# Altium project SynthyTwo.Project.PrjPcb
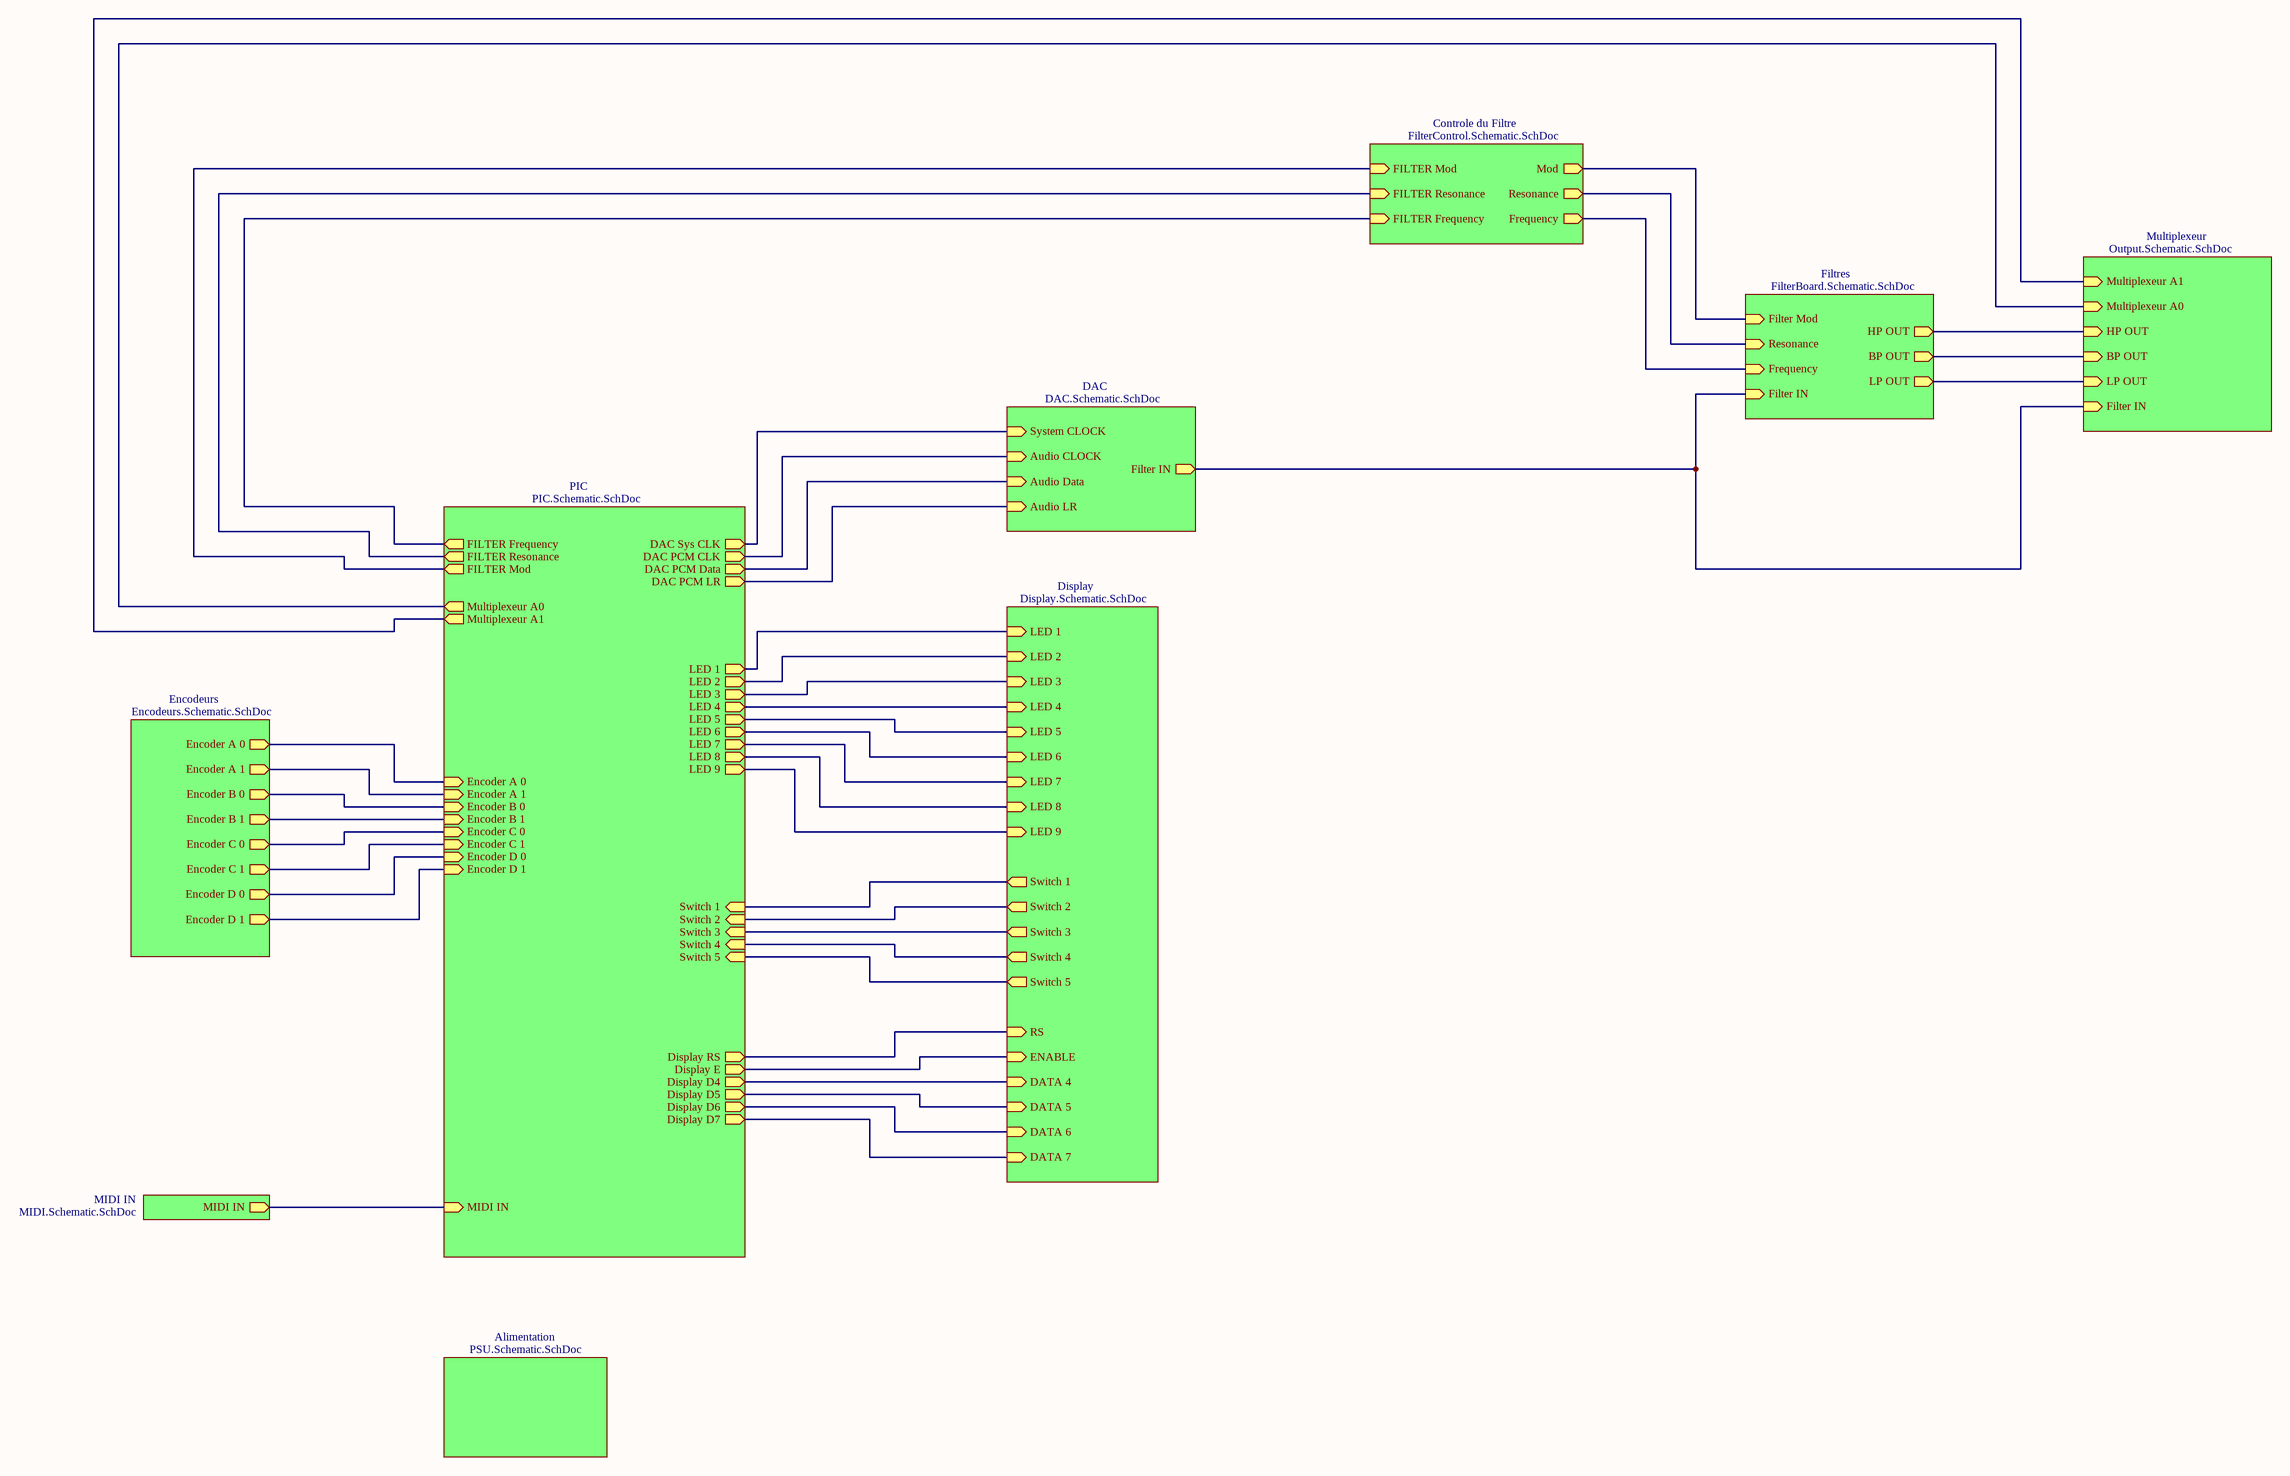
[diagram p0: LINK_PIC.SchDoc]
10 sheets, 235 parts. Net scope: hierarchical (ports join the sheet entries above them; power ports are global).
Board file: PCBROUTAGE.PcbDoc
Sheets:
  LINK_PIC.SchDoc
    Filtres = FilterBoard.Schematic.SchDoc
    Multiplexeur = Output.Schematic.SchDoc
    DAC = DAC.Schematic.SchDoc
    Controle du Filtre = FilterControl.Schematic.SchDoc
    MIDI IN = MIDI.Schematic.SchDoc
    PIC = PIC.Schematic.SchDoc
    Display = Display.Schematic.SchDoc
    Encodeurs = Encodeurs.Schematic.SchDoc
    Alimentation = PSU.Schematic.SchDoc

## Sheet LINK_PIC.SchDoc
size C

### Sub-sheets
Alimentation = PSU.Schematic.SchDoc: no entries
Controle du Filtre = FilterControl.Schematic.SchDoc: Frequency (out), Resonance (out), Mod (out), FILTER Frequency (in), FILTER Resonance (in), FILTER Mod (in)
DAC = DAC.Schematic.SchDoc: Filter IN (out), System CLOCK (in), Audio Data (in), Audio CLOCK (in), Audio LR (in)
Display = Display.Schematic.SchDoc: LED 1 (in), LED 2 (in), LED 3 (in), LED 4 (in), LED 5 (in), LED 6 (in), LED 7 (in), LED 8 (in), LED 9 (in), Switch 1 (out), Switch 2 (out), Switch 3 (out), Switch 4 (out), Switch 5 (out), RS (in), ENABLE (in), DATA 4 (in), DATA 5 (in), DATA 6 (in), DATA 7 (in)
Encodeurs = Encodeurs.Schematic.SchDoc: Encoder A 0 (out), Encoder A 1 (out), Encoder B 0 (out), Encoder B 1 (out), Encoder C 0 (out), Encoder C 1 (out), Encoder D 0 (out), Encoder D 1 (out)
Filtres = FilterBoard.Schematic.SchDoc: Filter IN (in), Filter Mod (in), Frequency (in), Resonance (in), BP OUT (out), HP OUT (out), LP OUT (out)
MIDI IN = MIDI.Schematic.SchDoc: MIDI IN (out)
Multiplexeur = Output.Schematic.SchDoc: Filter IN (in), BP OUT (in), HP OUT (in), LP OUT (in), Multiplexeur A0 (in), Multiplexeur A1 (in)
PIC = PIC.Schematic.SchDoc: LED 2 (out), LED 1 (out), LED 4 (out), LED 3 (out), LED 6 (out), LED 5 (out), LED 8 (out), LED 7 (out), LED 9 (out), DAC Sys CLK (out), DAC PCM CLK (out), DAC PCM Data (out), DAC PCM LR (out), Switch 1 (in), Switch 2 (in), Switch 3 (in), Switch 4 (in), Switch 5 (in), Display D4 (out), Display D5 (out), Display D6 (out), Display D7 (out), Display E (out), Display RS (out), MIDI IN (in), FILTER Frequency (out), FILTER Resonance (out), FILTER Mod (out), Multiplexeur A0 (out), Multiplexeur A1 (out), Encoder A 0 (in), Encoder A 1 (in), Encoder B 0 (in), Encoder B 1 (in), Encoder C 0 (in), Encoder C 1 (in), Encoder D 0 (in), Encoder D 1 (in)

### Nets
NetC14_2: sheet Filtres/Filter IN, sheet Multiplexeur/Filter IN, sheet DAC/Filter IN
NetDisplay_4: sheet PIC/Display RS, sheet Display/RS
NetDisplay_6: sheet PIC/Display E, sheet Display/ENABLE
NetDisplay_7: sheet PIC/Display D7, sheet Display/DATA 7
NetDisplay_8: sheet PIC/Display D6, sheet Display/DATA 6
NetDisplay_9: sheet PIC/Display D5, sheet Display/DATA 5
NetDisplay_10: sheet PIC/Display D4, sheet Display/DATA 4
NetR6_1: sheet MIDI IN/MIDI IN, sheet PIC/MIDI IN
NetR9_1: sheet DAC/System CLOCK, sheet PIC/DAC Sys CLK
NetR10_1: sheet DAC/Audio Data, sheet PIC/DAC PCM Data
NetR11_1: sheet DAC/Audio CLOCK, sheet PIC/DAC PCM CLK
NetR12_1: sheet DAC/Audio LR, sheet PIC/DAC PCM LR
NetR14_2: sheet Filtres/HP OUT, sheet Multiplexeur/HP OUT
NetR15_2: sheet Filtres/BP OUT, sheet Multiplexeur/BP OUT
NetR22_2: sheet Filtres/LP OUT, sheet Multiplexeur/LP OUT
NetR48_1: sheet Filtres/Resonance, sheet Controle du Filtre/Resonance
NetR53_1: sheet Filtres/Filter Mod, sheet Controle du Filtre/Mod
NetR57_1: sheet Filtres/Frequency, sheet Controle du Filtre/Frequency
NetR65_1: sheet Controle du Filtre/FILTER Frequency, sheet PIC/FILTER Frequency
NetR71_1: sheet Controle du Filtre/FILTER Resonance, sheet PIC/FILTER Resonance
NetR76_1: sheet Controle du Filtre/FILTER Mod, sheet PIC/FILTER Mod
NetR86_1: sheet PIC/LED 1, sheet Display/LED 1
NetR87_1: sheet PIC/LED 2, sheet Display/LED 2
NetR88_1: sheet PIC/LED 3, sheet Display/LED 3
NetR89_1: sheet PIC/Switch 5, sheet Display/Switch 5
NetR90_1: sheet PIC/Switch 4, sheet Display/Switch 4
NetR91_1: sheet PIC/Switch 3, sheet Display/Switch 3
NetR92_1: sheet PIC/Switch 2, sheet Display/Switch 2
NetR93_1: sheet PIC/Switch 1, sheet Display/Switch 1
NetR94_1: sheet PIC/LED 4, sheet Display/LED 4
NetR95_1: sheet PIC/LED 5, sheet Display/LED 5
NetR96_1: sheet PIC/LED 6, sheet Display/LED 6
NetR97_1: sheet PIC/LED 7, sheet Display/LED 7
NetR98_1: sheet PIC/LED 8, sheet Display/LED 8
NetR99_1: sheet PIC/LED 9, sheet Display/LED 9
NetR108_1: sheet PIC/Encoder A 0, sheet Encodeurs/Encoder A 0
NetR109_1: sheet PIC/Encoder A 1, sheet Encodeurs/Encoder A 1
NetR110_1: sheet PIC/Encoder B 0, sheet Encodeurs/Encoder B 0
NetR111_1: sheet PIC/Encoder B 1, sheet Encodeurs/Encoder B 1
NetR112_1: sheet PIC/Encoder C 0, sheet Encodeurs/Encoder C 0
NetR113_1: sheet PIC/Encoder C 1, sheet Encodeurs/Encoder C 1
NetR114_1: sheet PIC/Encoder D 0, sheet Encodeurs/Encoder D 0
NetR115_1: sheet PIC/Encoder D 1, sheet Encodeurs/Encoder D 1
NetU1_47: sheet Multiplexeur/Multiplexeur A1, sheet PIC/Multiplexeur A1
NetU1_48: sheet Multiplexeur/Multiplexeur A0, sheet PIC/Multiplexeur A0

## Sheet FilterBoard.Schematic.SchDoc
size B
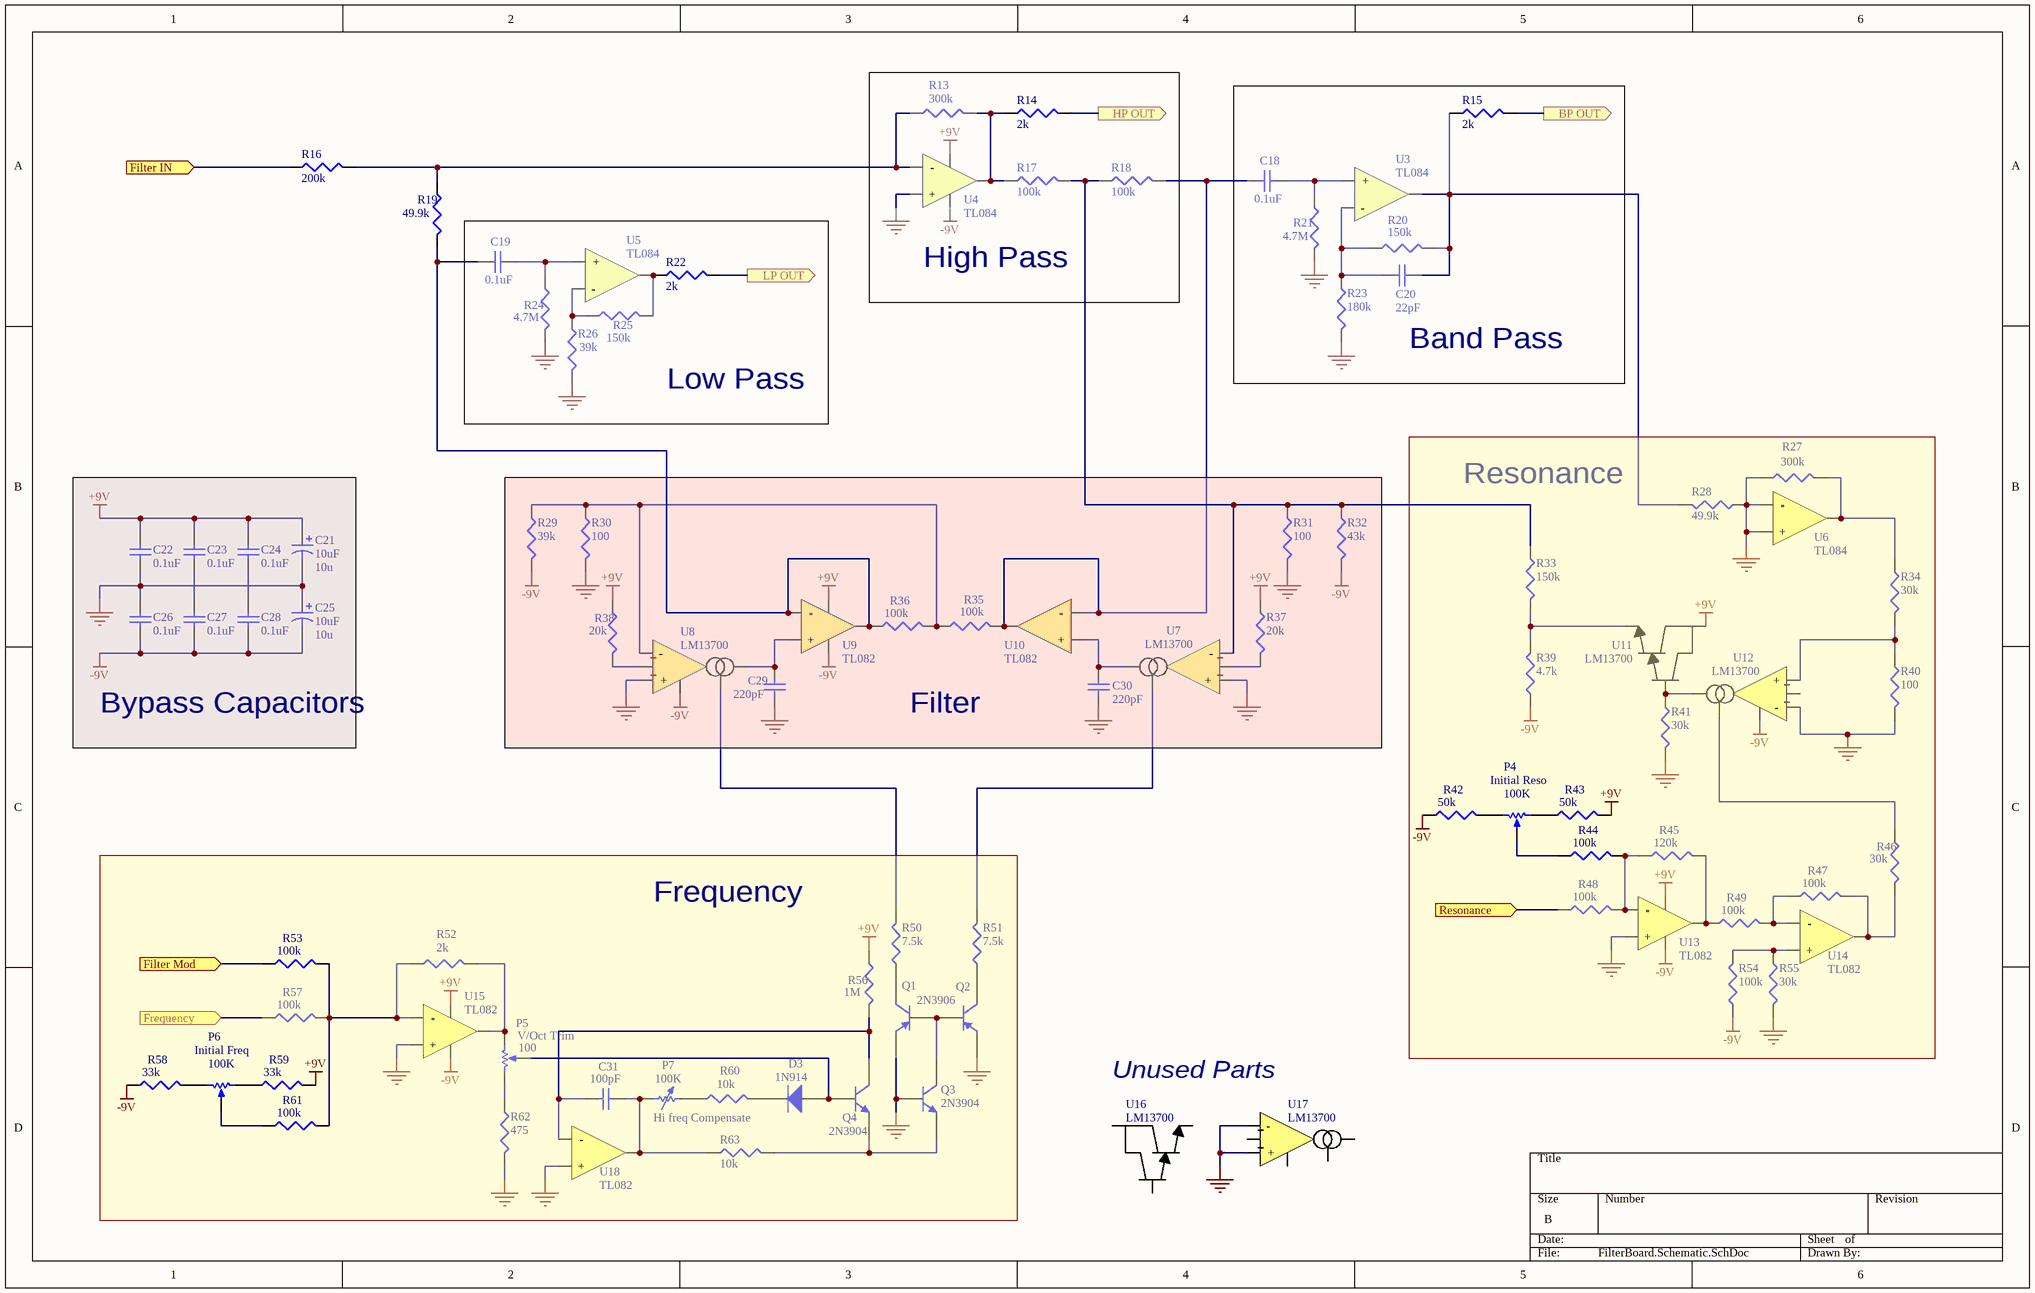
[diagram p1: FilterBoard.Schematic.SchDoc]

### Parts
C18  0.1uF  [CAPC1608N]
C19  0.1uF  [CAPC1608N]
C20  22pF  [CAPC1608N]
C21  10uF  value 10u  [RB7.6-15]
C22  0.1uF  [CAPC1608N]
C23  0.1uF  [CAPC1608N]
C24  0.1uF  [CAPC1608N]
C25  10uF  value 10u  [RB7.6-15]
C26  0.1uF  [CAPC1608N]
C27  0.1uF  [CAPC1608N]
C28  0.1uF  [CAPC1608N]
C29  220pF  [CAPC1608N]
C30  220pF  [CAPC1608N]
C31  100pF  [CAPC1608N]
D3  1N914  [1N914]
P4  Initial Reso  value 100K  [VR5]
P5  V/Oct Trim  value 100  [VR5]
P6  Initial Freq  value 100K  [VR5]
P7  Hi freq Compensate  value 100K  [CAPC1608N]
Q1  2N3906  [2N3906]
Q2  2N3906  [2N3906]  (value not drawn)
Q3  2N3904  [TO-92A]
Q4  2N3904  [TO-92A]
R13  300k  [CAPC1608N]
R14  2k  [CAPC1608N]
R15  2k  [CAPC1608N]
R16  200k  [CAPC1608N]
R17  100k  [CAPC1608N]
R18  100k  [CAPC1608N]
R19  49.9k  [CAPC1608N]
R20  150k  [CAPC1608N]
R21  4.7M  [CAPC1608N]
R22  2k  [CAPC1608N]
R23  180k  [CAPC1608N]
R24  4.7M  [CAPC1608N]
R25  150k  [CAPC1608N]
R26  39k  [CAPC1608N]
R27  300k  [CAPC1608N]
R28  49.9k  [CAPC1608N]
R29  39k  [CAPC1608N]
R30  100  [CAPC1608N]
R31  100  [CAPC1608N]
R32  43k  [CAPC1608N]
R33  150k  [CAPC1608N]
R34  30k  [CAPC1608N]
R35  100k  [CAPC1608N]
R36  100k  [CAPC1608N]
R37  20k  [CAPC1608N]
R38  20k  [CAPC1608N]
R39  4.7k  [CAPC1608N]
R40  100  [CAPC1608N]
R41  30k  [CAPC1608N]
R42  50k  [CAPC1608N]
R43  50k  [CAPC1608N]
R44  100k  [CAPC1608N]
R45  120k  [CAPC1608N]
R46  30k  [CAPC1608N]
R47  100k  [CAPC1608N]
R48  100k  [CAPC1608N]
R49  100k  [CAPC1608N]
R50  7.5k  [CAPC1608N]
R51  7.5k  [CAPC1608N]
R52  2k  [CAPC1608N]
R53  100k  [CAPC1608N]
R54  100k  [CAPC1608N]
R55  30k  [CAPC1608N]
R56  1M  [CAPC1608N]
R57  100k  [CAPC1608N]
R58  33k  [CAPC1608N]
R59  33k  [CAPC1608N]
R60  10k  [CAPC1608N]
R61  100k  [CAPC1608N]
R62  475  [CAPC1608N]
R63  10k  [CAPC1608N]
U3  TL084
U4  TL084
U5  TL084
U6  TL084
U7  LM13700  [LM13700]
U8  LM13700  [LM13700]
U9  TL082  [TL084]
U10  TL082  [TL084]
U11  LM13700
U12  LM13700  [LM13700]
U13  TL082  [TL084]
U14  TL082  [TL084]
U15  TL082  [TL084]
U16  LM13700
U17  LM13700  [LM13700]
U18  TL082  [TL084]

### Blocks framed on the sheet
High Pass: R13 R14 R17 R18 U4
Band Pass: C18 C20 R15 R20 R21 R23 U3
Low Pass: C19 R22 R24-R26 U5
Resonance: P4 R27 R28 R33 R34 R39-R49 R54 R55 U6 U11-U14
Bypass Capacitors: C21-C28
Filter: C29 C30 R29-R32 R35-R38 U7-U10
Frequency: C31 D3 P5-P7 Q1-Q4 R50-R53 R56-R63 U15 U18

### Ports
BP OUT (out), Filter IN (in), Filter Mod (in), Frequency (in), HP OUT (out), LP OUT (out), Resonance (in)

### Nets
+9V: C21.1 C22.2 C23.2 C24.2 R37.1 R38.1 R43.2 R56.1 R59.2 U4.4(VCC+) U9.8(VCC+) U11.11(V+) U13.8(VCC+) U15.8(VCC+)
-9V: C25.2 C26.1 C27.1 C28.1 R29.2 R32.2 R39.1 R42.1 R54.1 R58.1 U4.11(VCC-) U8.6(VCC-) U9.4(VCC-) U12.6(VCC-) U13.4(VCC-) U15.4(VCC-)
GND: C21.2 C22.1 C25.1 C26.2 C29.1 C30.1 Q1.1(E) Q2.1(E) Q3.2(B) R21.2 R23.2 R24.2 R26.2 R27.1 R28.1 R30.2 R31.2 R40.2 R41.2 R55.2 R62.2 U4.3(+) U6.12(-) U6.13(+) U7.3(+) U8.3(+) U12.3(-) U13.3(+) U15.3(+) U17.3(+) U17.4(-) U18.5(+)
NetC14_2: R16.1 ; port Filter IN
NetC18_1: C18.1 R18.2 R35.2 U10.6(-) U10.7(OUT)
NetC18_2: C18.2 R21.1 U3.5(+)
NetC19_1: C19.1 R19.2 R36.1 U9.1(OUT) U9.2(-)
NetC19_2: C19.2 R24.1 U5.5(+)
NetC20_1: C20.1 R20.1 R23.1 U3.3(-)
NetC20_2: C20.2 R15.1 R20.2 R28.2 U3.7(OUT)
NetC23_1: C23.1 C27.2
NetC24_1: C24.1 C28.2
NetC29_2: C29.2 U8.5(OUT) U9.3(+)
NetC30_2: C30.2 U7.5(OUT) U10.5(+)
NetC31_1: C31.1 Q4.3(C) R56.2 U18.6(-)
NetC31_2: C31.2 P7.1 R63.1 U18.7(OUT)
NetD3_1: D3.1(A) P5.3(TAP) Q4.2(B)
NetD3_2: D3.2(K) R60.2
NetP4_1: P4.1(TOP) R43.1
NetP4_2: P4.2(BOT) R42.2
NetP4_3: P4.3(TAP) R44.1
NetP5_1: P5.1(TOP) R52.2 U15.1(OUT)
NetP5_2: P5.2(BOT) R62.1
NetP6_1: P6.1(TOP) R59.1
NetP6_2: P6.2(BOT) R58.2
NetP6_3: P6.3(TAP) R61.1
NetP7_2: P7.2 R60.1
NetQ1_2: Q1.2(B) Q2.2(B) Q3.3(C)
NetQ1_3: Q1.3(C) R50.1
NetQ2_3: Q2.3(C) R51.1
NetQ3_1: Q3.1(E) Q4.1(E) R63.2
NetR13_1: R13.1 R16.2 R19.1 U4.2(-)
NetR13_2: R13.2 R14.1 R17.1 U4.1(OUT)
NetR14_2: R14.2 ; port HP OUT
NetR15_2: R15.2 ; port BP OUT
NetR17_2: R17.2 R18.1 R31.1 R32.1 R33.1 U7.4(-)
NetR22_1: R22.1 R25.2 U5.7(OUT)
NetR22_2: R22.2 ; port LP OUT
NetR25_1: R25.1 R26.1 U5.3(-)
NetR27_2: R27.2 R34.1 U6.14(OUT)
NetR29_1: R29.1 R30.1 R35.1 R36.2 U8.4(-)
NetR33_2: R33.2 R39.2 U11.8(BOUT)
NetR34_2: R34.2 R40.1 U12.4(+)
NetR37_2: R37.2 U7.2
NetR38_2: R38.2 U8.2
NetR41_1: R41.1 U11.7(BIN) U12.5(OUT)
NetR44_2: R44.2 R45.1 R48.2 U13.2(-)
NetR45_2: R45.2 R49.1 U13.1(OUT)
NetR46_1: R46.1 U12.1(BIAS)
NetR46_2: R46.2 R47.2 U14.7(OUT)
NetR47_1: R47.1 R49.2 U14.6(-)
NetR48_1: R48.1 ; port Resonance
NetR50_2: R50.2 U8.1(BIAS)
NetR51_2: R51.2 U7.1(BIAS)
NetR52_1: R52.1 R53.2 R57.2 R61.2 U15.2(-)
NetR53_1: R53.1 ; port Filter Mod
NetR54_2: R54.2 R55.1 U14.5(+)
NetR57_1: R57.1 ; port Frequency

Not connected (* = marked no-connect by the designer): U3 6(VCC+) 11(VCC-); U5 6(VCC+) 11(VCC-); U6 1(VCC+) 11(VCC-); U7 6(VCC-); U10 4(VCC-) 8(VCC+); U12 2; U14 4(VCC-) 8(VCC+); U16 7(BIN) 8(BOUT) 11(V+); U17 1(BIAS) 2 5(OUT) 6(VCC-); U18 4(VCC-) 8(VCC+)

### Notes on the sheet
- Unused Parts

### Library data of the parts
C18 C19 C22-C24 C26-C28 = Cap Semi: Capacitor (Semiconductor SIM Model); Value: 0.1u; Published: 8-Jun-2000; LatestRevisionDate: 29-May-2009; LatestRevisionNote: IPC-7351 Footprint Added.; PackageReference: C1206; Publisher: Altium Limited; PackageDescription: Chip Capacitor
C20 = Cap Semi: Capacitor (Semiconductor SIM Model); Value: 22p; Published: 8-Jun-2000; LatestRevisionDate: 29-May-2009; LatestRevisionNote: IPC-7351 Footprint Added.; PackageReference: C1206; Publisher: Altium Limited; PackageDescription: Chip Capacitor
C21 C25 = Cap Pol1: Polarized Capacitor (Radial); Published: 8-Jun-2000; LatestRevisionDate: 17-Jul-2002; LatestRevisionNote: Re-released for DXP Platform.; PackageReference: RB7.6-15; Publisher: Altium Limited; PackageDescription: Polarized Capacitor (Radial); 2 Leads
C29 C30 = Cap Semi: Capacitor (Semiconductor SIM Model); Value: 220p; Published: 8-Jun-2000; LatestRevisionDate: 29-May-2009; LatestRevisionNote: IPC-7351 Footprint Added.; PackageReference: C1206; Publisher: Altium Limited; PackageDescription: Chip Capacitor
C31 = Cap Semi: Capacitor (Semiconductor SIM Model); Value: 100p; Published: 8-Jun-2000; LatestRevisionDate: 29-May-2009; LatestRevisionNote: IPC-7351 Footprint Added.; PackageReference: C1206; Publisher: Altium Limited; PackageDescription: Chip Capacitor
D3 = Diode 1N4001: 1 Amp General Purpose Rectifier; Published: 8-Jun-2000; LatestRevisionDate: 17-Jul-2002; LatestRevisionNote: Re-released for DXP Platform.; DatasheetVersion: 1998; PackageVersion: Aug-1999; PackageReference: DO-41; Publisher: Altium Limited; PackageDescription: Diode, Axial; Body 5.2 x 2.7 mm (LxDia. max), Lead Dia. 0.86 mm (max); Code_JEDEC: DO-204-AL; ComponentLink1Description: Manufacturer Link; ComponentLink1URL: http://www.fairchildsemi.com/; ComponentLink2Description: Datasheet; ComponentLink2URL: http://www.fairchildsemi.com/ds/1N%2F1N4001.pdf
P4-P6 = RPot: Potentiometer; Sim Note: Enter the Resistance value and the set point into parameter fields.; Set Position: 0.5; Published: 8-Jun-2000; LatestRevisionDate: 17-Jul-2002; LatestRevisionNote: Re-released for DXP Platform.; PackageReference: VR5; Publisher: Altium Limited; PackageDescription: Variable Resistor, Thru-Hole; 3 Leads
P7 = Res Adj1: Variable Resistor; Set Position: 0.5; Published: 8-Jun-2000; LatestRevisionDate: 17-Jul-2002; LatestRevisionNote: Re-released for DXP Platform.; PackageReference: AXIAL-0.7; Publisher: Altium Limited; PackageDescription: Axial Device, Thru-Hole; 2 Leads; 0.7 in Pin Spacing
Q1 Q2 = 2N3906: PNP General Purpose Amplifier; Published: 8-Jun-2000; LatestRevisionDate: 15-Jan-2003; LatestRevisionNote: PCB Footprint 'BCY-W3/D4.7' replaced; DatasheetVersion: 1997; PackageVersion: Sep-1998; PackageReference: TO-92A; Publisher: Altium Limited; PackageDescription: TO, Flat Index; 3 In-Line, Axial Leads; Body Dia. 4.5mm; Leads 0.51 x 0.48 mm (max); ComponentLink1Description: Manufacturer Link; ComponentLink1URL: http://www.fairchildsemi.com/; ComponentLink2Description: Datasheet; ComponentLink2URL: http://www.fairchildsemi.com/ds/2N%2F2N3906.pdf
Q3 Q4 = 2N3904: NPN General Purpose Amplifier; Published: 8-Jun-2000; LatestRevisionDate: 15-Jan-2003; LatestRevisionNote: PCB Footprint 'BCY-W3/D4.7' replaced; DatasheetVersion: 1997; PackageVersion: Sep-1998; PackageReference: TO-92A; Publisher: Altium Limited; PackageDescription: TO, Flat Index; 3 In-Line, Axial Leads; Body Dia. 4.5mm; Leads 0.51 x 0.48 mm (max); ComponentLink1Description: Manufacturer Link; ComponentLink1URL: http://www.fairchildsemi.com/; ComponentLink2Description: Datasheet; ComponentLink2URL: http://www.fairchildsemi.com/ds/2N%2F2N3904.pdf
R13-R63 = Res3: Resistor; Published: 8-Jun-2000; LatestRevisionDate: 29-May-2009; LatestRevisionNote: IPC-7351 Footprint Added.; PackageReference: J1-0603; Publisher: Altium Limited; PackageDescription: Chip Resistor
  R13 R27: Value: 300K
  R14 R15 R22 R52: Value: 2K
  R16: Value: 200K
  R17 R18 R35 R36 R44 R47-R49 R53 R54 R57 R61: Value: 100K
  R19 R28: Value: 49.9K
  R20 R25 R33: Value: 150K
  R21 R24: Value: 4.7M
  R23: Value: 180K
  R26 R29: Value: 39K
  R30 R31 R40: Value: 100
  R32: Value: 43K
  R34 R41 R46 R55: Value: 30K
  R37 R38: Value: 20K
  R39: Value: 4.7K
  R42 R43: Value: 50K
  R45: Value: 120K
  R50 R51: Value: 7.5K
  R56: Value: 1M
  R58 R59: Value: 33K
  R60 R63: Value: 10K
  R62: Value: 475
U11 U16 = LM13700_1

## Sheet Output.Schematic.SchDoc
size A
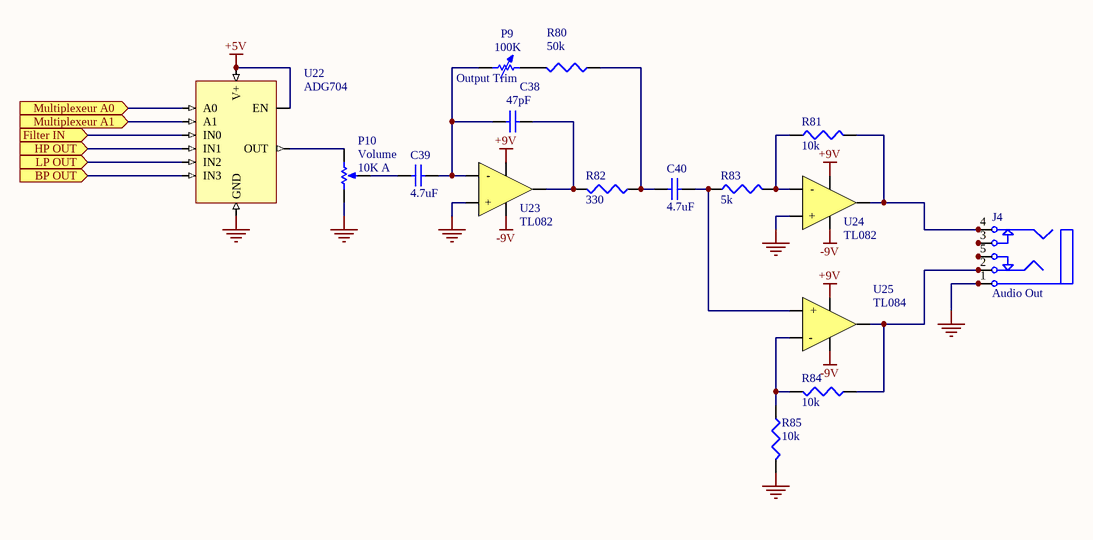
[diagram p2: Output.Schematic.SchDoc]

### Parts
C38  47pF  [CAPC1608N]
C39  4.7uF  [CAP1608N]
C40  4.7uF  [CAPC1608N]
J4  Audio Out  [ST-3150-5N]
P9  Output Trim  value 100K  [AXIAL-0.7]
P10  Volume  value 10K A  [EC12E]
R80  50k  [CAPC1608N]
R81  10k  [CAPC1608N]
R82  330  [CAPC1608N]
R83  5k  [CAPC1608N]
R84  10k  [J1-0603]
R85  10k  [RESC6332]
U22  ADG704  [ADG704]
U23  TL082
U24  TL082
U25  TL084

### Ports
BP OUT (in), Filter IN (in), HP OUT (in), LP OUT (in), Multiplexeur A0 (in), Multiplexeur A1 (in)

### Nets
+5V: U22.5(EN) U22.6(V+)
+9V: U23.8(VCC+) U24.8(VCC+) U25.4(VCC+)
-9V: U23.4(VCC-) U24.4(VCC-) U25.11(VCC-)
GND: J4.1 J4.1A J4.1B P10.1(TOP) R85.2 U22.3(GND) U23.3(+) U24.3(+)
NetC14_2: U22.2(IN0) ; port Filter IN
NetC38_1: C38.1 C39.2 P9.1 U23.2(-)
NetC38_2: C38.2 R82.2 U23.1(OUT)
NetC39_1: C39.1 P10.3(TAP)
NetC40_1: C40.1 R80.1 R82.1
NetC40_2: C40.2 R83.1 U25.2(+)
NetJ4_2: J4.2 J4.2A J4.2B R84.1 U25.1(OUT)
NetJ4_3: J4.3 J4.3A J4.3B
NetJ4_4: J4.4 J4.4A J4.4B R81.2 U24.1(OUT)
NetJ4_5: J4.5 J4.5A J4.5B
NetP9_2: P9.2 R80.2
NetP10_2: P10.2(BOT) U22.8(OUT)
NetR14_2: U22.9(IN1) ; port HP OUT
NetR15_2: U22.7(IN3) ; port BP OUT
NetR22_2: U22.4(IN2) ; port LP OUT
NetR81_1: R81.1 R83.2 U24.2(-)
NetR84_2: R84.2 R85.1 U25.3(-)
NetU1_47: U22.10(A1) ; port Multiplexeur A1
NetU1_48: U22.1(A0) ; port Multiplexeur A0

### Library data of the parts
C38 = Cap Semi: Capacitor (Semiconductor SIM Model); Published: 8-Jun-2000; LatestRevisionDate: 29-May-2009; LatestRevisionNote: IPC-7351 Footprint Added.; PackageReference: C1206; Publisher: Altium Limited; PackageDescription: Chip Capacitor; Value: 47pF
C39 C40 = Cap Semi: Capacitor (Semiconductor SIM Model); Value: 4.7u; Published: 8-Jun-2000; LatestRevisionDate: 29-May-2009; LatestRevisionNote: IPC-7351 Footprint Added.; PackageReference: C1206; Publisher: Altium Limited; PackageDescription: Chip Capacitor
J4 = Phonejack Stereo SW: 3-Conductor Jack with 2 break contacts (normals) and 2 auxiliary make contacts; Published: 5-Jan-2004; LatestRevisionDate: 17-Dec-2003; LatestRevisionNote: PCB Footprint replaced.; DatasheetDocument: 07-Mar-2000; Publisher: Altium Limited; ComponentLink1Description: Manufacturer Link; ComponentLink1URL: http://domino.kycon.com/internet/Products.html
P9 = Res Adj1: Variable Resistor; Set Position: 0.5; Published: 8-Jun-2000; LatestRevisionDate: 17-Jul-2002; LatestRevisionNote: Re-released for DXP Platform.; PackageReference: AXIAL-0.7; Publisher: Altium Limited; PackageDescription: Axial Device, Thru-Hole; 2 Leads; 0.7 in Pin Spacing
P10 = RPot: as P4 on sheet FilterBoard.Schematic; Published: 8-Jun-2000; LatestRevisionDate: 17-Jul-2002; LatestRevisionNote: Re-released for DXP Platform.; PackageReference: VR5; Publisher: Altium Limited; PackageDescription: Variable Resistor, Thru-Hole; 3 Leads
R80-R85 = Res3: Resistor; Published: 8-Jun-2000; LatestRevisionDate: 29-May-2009; LatestRevisionNote: IPC-7351 Footprint Added.; PackageReference: J1-0603; Publisher: Altium Limited; PackageDescription: Chip Resistor
  R80: Value: 50K
  R81 R84 R85: Value: 10K
  R82: Value: 330
  R83: Value: 5K

## Sheet DAC.Schematic.SchDoc
size A
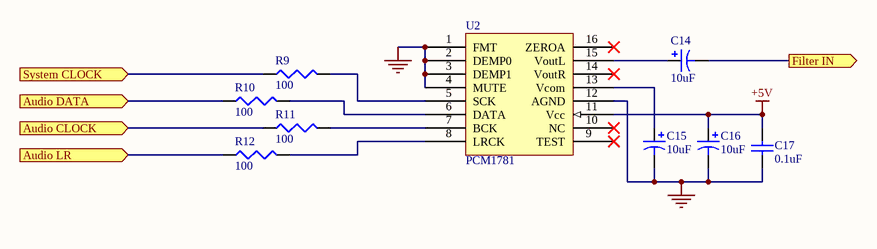
[diagram p3: DAC.Schematic.SchDoc]

### Parts
C14  10uF  [CAPC1608N]
C15  10uF  [CAPC1608N]
C16  10uF  [CAPC1608N]
C17  0.1uF  [CAPC1608N]
R9  100  [CAPC1608N]
R10  100  [CAPC1608N]
R11  100  [CAPC1608N]
R12  100  [CAPC1608N]
U2  PCM1781  [PCM1781]

### Ports
Audio CLOCK (in), Audio DATA (in), Audio LR (in), Filter IN (out), System CLOCK (in)

### Nets
+5V: C16.1 C17.2 U2.11(Vcc)
NetC15_2: C15.2 C16.2 C17.1 U2.1(FMT) U2.2(DEMP0) U2.3(DEMP1) U2.4(MUTE) U2.12(AGND)
NetC14_1: C14.1 U2.15(VoutL)
NetC14_2: C14.2 ; port Filter IN
NetC15_1: C15.1 U2.13(Vcom)
NetR9_1: R9.1 ; port System CLOCK
NetR9_2: R9.2 U2.5(SCK)
NetR10_1: R10.1 ; port Audio DATA
NetR10_2: R10.2 U2.6(DATA)
NetR11_1: R11.1 ; port Audio CLOCK
NetR11_2: R11.2 U2.7(BCK)
NetR12_1: R12.1 ; port Audio LR
NetR12_2: R12.2 U2.8(LRCK)

Not connected (* = marked no-connect by the designer): U2 9(TEST)* 10(NC)* 14(VoutR)* 16(ZEROA)*

### Library data of the parts
C14-C16 = Cap Pol1: Polarized Capacitor (Radial); Published: 8-Jun-2000; LatestRevisionDate: 17-Jul-2002; LatestRevisionNote: Re-released for DXP Platform.; PackageReference: RB7.6-15; Publisher: Altium Limited; PackageDescription: Polarized Capacitor (Radial); 2 Leads; Value: 10uF
C17 = Cap Semi: as C18 on sheet FilterBoard.Schematic; Published: 8-Jun-2000; LatestRevisionDate: 29-May-2009; LatestRevisionNote: IPC-7351 Footprint Added.; PackageReference: C1206; Publisher: Altium Limited; PackageDescription: Chip Capacitor
R9-R12 = Res3: Resistor; Published: 8-Jun-2000; LatestRevisionDate: 29-May-2009; LatestRevisionNote: IPC-7351 Footprint Added.; PackageReference: J1-0603; Publisher: Altium Limited; PackageDescription: Chip Resistor; Value: 100
U2 = PCM1781 DAC

## Sheet FilterControl.Schematic.SchDoc
size A
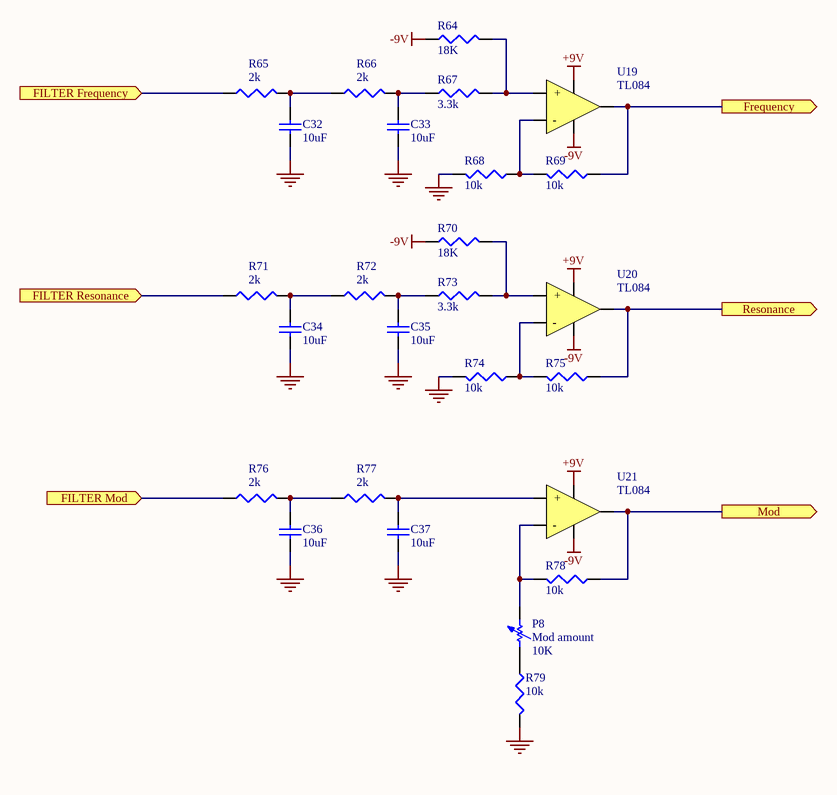
[diagram p4: FilterControl.Schematic.SchDoc]

### Parts
C32  10uF  [CAPC1608N]
C33  10uF  [CAPC1608N]
C34  10uF  [CAPC1608N]
C35  10uF  [CAPC1608N]
C36  10uF  [CAPC1608N]
C37  10uF  [CAPC1608N]
P8  Mod amount  value 10K  [AXIAL-0.7]
R64  18K  [CAPC1608N]
R65  2k  [CAPC1608N]
R66  2k  [CAPC1608N]
R67  3.3k  [CAPC1608N]
R68  10k  [CAPC1608N]
R69  10k  [CAPC1608N]
R70  18K  [CAPC1608N]
R71  2k  [CAPC1608N]
R72  2k  [CAPC1608N]
R73  3.3k  [CAPC1608N]
R74  10k  [CAPC1608N]
R75  10k  [CAPC1608N]
R76  2k  [CAPC1608N]
R77  2k  [CAPC1608N]
R78  10k  [CAPC1608N]
R79  10k  [CAPC1608N]
U19  TL084  [TL084]
U20  TL084  [TL084]
U21  TL084  [TL084]

### Ports
FILTER Frequency (in), FILTER Mod (in), FILTER Resonance (in), Frequency (out), Mod (out), Resonance (out)

### Nets
+9V: U19.4(VCC+) U20.4(VCC+) U21.4(VCC+)
-9V: R64.1 R70.1 U19.11(VCC-) U20.11(VCC-) U21.11(VCC-)
GND: C32.1 C33.1 C34.1 C35.1 C36.1 C37.1 R68.2 R74.2 R79.2
NetC32_2: C32.2 R65.2 R66.1
NetC33_2: C33.2 R66.2 R67.1
NetC34_2: C34.2 R71.2 R72.1
NetC35_2: C35.2 R72.2 R73.1
NetC36_2: C36.2 R76.2 R77.1
NetC37_2: C37.2 R77.2 U21.2(+)
NetP8_1: P8.1 R79.1
NetP8_2: P8.2 R78.2 U21.3(-)
NetR48_1: R75.1 U20.1(OUT) ; port Resonance
NetR53_1: R78.1 U21.1(OUT) ; port Mod
NetR57_1: R69.1 U19.1(OUT) ; port Frequency
NetR64_2: R64.2 R67.2 U19.2(+)
NetR65_1: R65.1 ; port FILTER Frequency
NetR68_1: R68.1 R69.2 U19.3(-)
NetR70_2: R70.2 R73.2 U20.2(+)
NetR71_1: R71.1 ; port FILTER Resonance
NetR74_1: R74.1 R75.2 U20.3(-)
NetR76_1: R76.1 ; port FILTER Mod

### Library data of the parts
C32-C37 = Cap Semi: Capacitor (Semiconductor SIM Model); Value: 10u; Published: 8-Jun-2000; LatestRevisionDate: 29-May-2009; LatestRevisionNote: IPC-7351 Footprint Added.; PackageReference: C1206; Publisher: Altium Limited; PackageDescription: Chip Capacitor
P8 = Res Adj1: Variable Resistor; Set Position: 0.5; Published: 8-Jun-2000; LatestRevisionDate: 17-Jul-2002; LatestRevisionNote: Re-released for DXP Platform.; PackageReference: AXIAL-0.7; Publisher: Altium Limited; PackageDescription: Axial Device, Thru-Hole; 2 Leads; 0.7 in Pin Spacing
R64-R79 = Res3: Resistor; Published: 8-Jun-2000; LatestRevisionDate: 29-May-2009; LatestRevisionNote: IPC-7351 Footprint Added.; PackageReference: J1-0603; Publisher: Altium Limited; PackageDescription: Chip Resistor
  R64 R70: Value: 18K
  R65 R66 R71 R72 R76 R77: Value: 2K
  R67 R73: Value: 3.3K
  R68 R69 R74 R75 R78 R79: Value: 10K

## Sheet MIDI.Schematic.SchDoc
size A
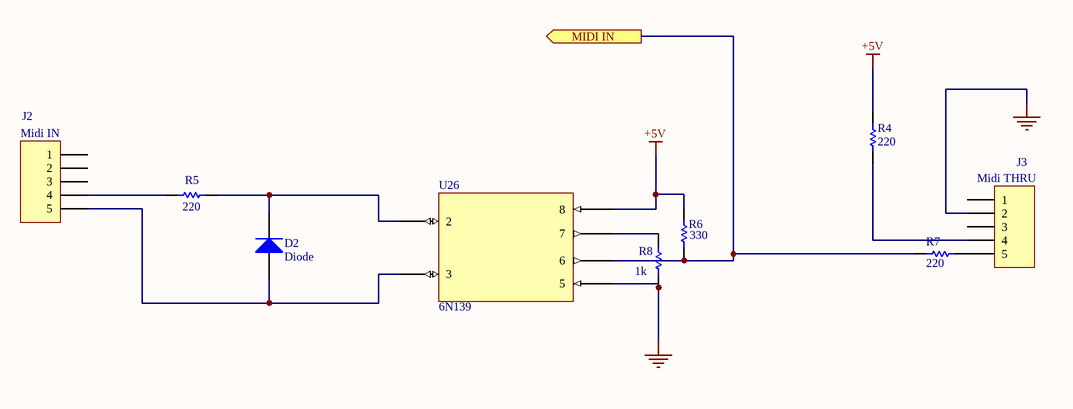
[diagram p5: MIDI.Schematic.SchDoc]

### Parts
D2  Diode  [SMC]
J2  Midi IN  [PCB DIN Socket]
J3  Midi THRU  [PCB DIN Socket]
R4  value 220  [CAPC1608N]  (hidden comment: Res1)
R5  value 220  [CAPC1608N]  (hidden comment: Res1)
R6  330  [CAPC1608N]
R7  value 220  [CAPC1608N]  (hidden comment: Res1)
R8  1k  [CAPC1608N]
U26  6N139  [6N139]

### Ports
MIDI IN (out)

### Nets
+5V: R4.2 R6.2 U26.?3(8)
GND: J3.2 R8.1 U26.?4(5)
NetD2_1: D2.1(A) J2.5 U26.?1(3)
NetD2_2: D2.2(K) R5.2 U26.?2(2)
NetJ2_4: J2.4 R5.1
NetJ3_4: J3.4 R4.1
NetJ3_5: J3.5 R7.1
NetR6_1: R6.1 R7.2 U26.?6(6) ; port MIDI IN
NetR8_2: R8.2 U26.?5(7)

Not connected (* = marked no-connect by the designer): J2 1 2 3; J3 1 3

### Library data of the parts
D2 = Diode: Default Diode; Published: 8-Jun-2000; LatestRevisionDate: 17-Jul-2002; LatestRevisionNote: Re-released for DXP Platform.; PackageVersion: Sep-1996; PackageReference: SMC; Publisher: Altium Limited; PackageDescription: DO-214-AB/SMC; 2 C-Bend Leads; Body 7.9 x 5.9 mm, inc. leads (LxW); Code_JEDEC: DO-214-AB
J2 J3 = Header 5: DIN 5 Pins; LatestRevisionDate: 17-Jul-2002; LatestRevisionNote: Re-released for DXP Platform.; Publisher: Altium Limited
R4-R8 = Res1: Resistor; Published: 8-Jun-2000; LatestRevisionDate: 17-Jul-2002; LatestRevisionNote: Re-released for DXP Platform.; PackageReference: AXIAL-0.3; Publisher: Altium Limited; PackageDescription: Axial Device, Thru-Hole; 2 Leads; 0.3 in Pin Spacing
  R6: Value: 330
  R8: Value: 1K

## Sheet PIC.Schematic.SchDoc
size A
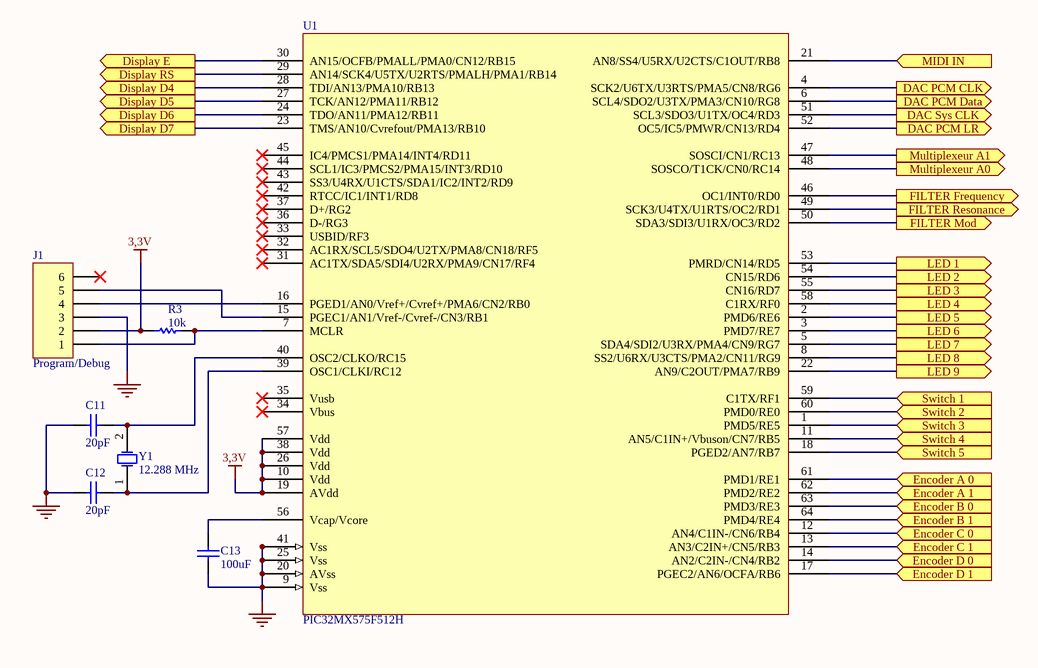
[diagram p6: PIC.Schematic.SchDoc]

### Parts
C11  20pF  [CAP1608N]
C12  20pF  [CAP1608N]
C13  value 100uF  [RAD-0.3]  (hidden comment: Cap)
J1  Program/Debug  [RJ11]
R3  10k  [CAPC1608N]
U1  PIC32MX575F512H  [PIC32]
Y1  12.288 MHz  [HC49/4H SMX CRYSTAL]

### Ports
DAC PCM CLK (out), DAC PCM Data (out), DAC PCM LR (out), DAC Sys CLK (out), Display D4 (out), Display D5 (out), Display D6 (out), Display D7 (out), Display E (out), Display RS (out), Encoder A 0 (in), Encoder A 1 (in), Encoder B 0 (in), Encoder B 1 (in), Encoder C 0 (in), Encoder C 1 (in), Encoder D 0 (in), Encoder D 1 (in), FILTER Frequency (out), FILTER Mod (out), FILTER Resonance (out), LED 1 (out), LED 2 (out), LED 3 (out), LED 4 (out), LED 5 (out), LED 6 (out), LED 7 (out), LED 8 (out), LED 9 (out), MIDI IN (in), Multiplexeur A0 (out), Multiplexeur A1 (out), Switch 1 (in), Switch 2 (in), Switch 3 (in), Switch 4 (in), Switch 5 (in)

### Nets
3,3V: J1.2 R3.2 U1.10(Vdd) U1.19(AVdd) U1.26(Vdd) U1.38(Vdd) U1.57(Vdd)
GND: C11.1 C12.1 C13.1 J1.3 U1.9(Vss) U1.20(AVss) U1.25(Vss) U1.41(Vss)
NetC11_2: C11.2 U1.40(OSC2/CLKO/RC15) Y1.2(OSC2)
NetC12_2: C12.2 U1.39(OSC1/CLKI/RC12) Y1.1(OSC1)
NetC13_2: C13.2 U1.56(Vcap/Vcore)
NetDisplay_4: U1.29(AN14/SCK4/U5TX/U2RTS/PMALH/PMA1/RB14) ; port Display RS
NetDisplay_6: U1.30(AN15/OCFB/PMALL/PMA0/CN12/RB15) ; port Display E
NetDisplay_7: U1.23(TMS/AN10/Cvrefout/PMA13/RB10) ; port Display D7
NetDisplay_8: U1.24(TDO/AN11/PMA12/RB11) ; port Display D6
NetDisplay_9: U1.27(TCK/AN12/PMA11/RB12) ; port Display D5
NetDisplay_10: U1.28(TDI/AN13/PMA10/RB13) ; port Display D4
NetJ1_1: J1.1 R3.1 U1.7(MCLR)
NetJ1_4: J1.4 U1.16(PGED1/AN0/Vref+/Cvref+/PMA6/CN2/RB0)
NetJ1_5: J1.5 U1.15(PGEC1/AN1/Vref-/Cvref-/CN3/RB1)
NetR6_1: U1.21(AN8/SS4/U5RX/U2CTS/C1OUT/RB8) ; port MIDI IN
NetR9_1: U1.51(SCL3/SDO3/U1TX/OC4/RD3) ; port DAC Sys CLK
NetR10_1: U1.6(SCL4/SDO2/U3TX/PMA3/CN10/RG8) ; port DAC PCM Data
NetR11_1: U1.4(SCK2/U6TX/U3RTS/PMA5/CN8/RG6) ; port DAC PCM CLK
NetR12_1: U1.52(OC5/IC5/PMWR/CN13/RD4) ; port DAC PCM LR
NetR65_1: U1.46(OC1/INT0/RD0) ; port FILTER Frequency
NetR71_1: U1.49(SCK3/U4TX/U1RTS/OC2/RD1) ; port FILTER Resonance
NetR76_1: U1.50(SDA3/SDI3/U1RX/OC3/RD2) ; port FILTER Mod
NetR86_1: U1.53(PMRD/CN14/RD5) ; port LED 1
NetR87_1: U1.54(CN15/RD6) ; port LED 2
NetR88_1: U1.55(CN16/RD7) ; port LED 3
NetR89_1: U1.18(PGED2/AN7/RB7) ; port Switch 5
NetR90_1: U1.11(AN5/C1IN+/Vbuson/CN7/RB5) ; port Switch 4
NetR91_1: U1.1(PMD5/RE5) ; port Switch 3
NetR92_1: U1.60(PMD0/RE0) ; port Switch 2
NetR93_1: U1.59(C1TX/RF1) ; port Switch 1
NetR94_1: U1.58(C1RX/RF0) ; port LED 4
NetR95_1: U1.2(PMD6/RE6) ; port LED 5
NetR96_1: U1.3(PMD7/RE7) ; port LED 6
NetR97_1: U1.5(SDA4/SDI2/U3RX/PMA4/CN9/RG7) ; port LED 7
NetR98_1: U1.8(SS2/U6RX/U3CTS/PMA2/CN11/RG9) ; port LED 8
NetR99_1: U1.22(AN9/C2OUT/PMA7/RB9) ; port LED 9
NetR108_1: U1.61(PMD1/RE1) ; port Encoder A 0
NetR109_1: U1.62(PMD2/RE2) ; port Encoder A 1
NetR110_1: U1.63(PMD3/RE3) ; port Encoder B 0
NetR111_1: U1.64(PMD4/RE4) ; port Encoder B 1
NetR112_1: U1.12(AN4/C1IN-/CN6/RB4) ; port Encoder C 0
NetR113_1: U1.13(AN3/C2IN+/CN5/RB3) ; port Encoder C 1
NetR114_1: U1.14(AN2/C2IN-/CN4/RB2) ; port Encoder D 0
NetR115_1: U1.17(PGEC2/AN6/OCFA/RB6) ; port Encoder D 1
NetU1_47: U1.47(SOSCI/CN1/RC13) ; port Multiplexeur A1
NetU1_48: U1.48(SOSCO/T1CK/CN0/RC14) ; port Multiplexeur A0

Not connected (* = marked no-connect by the designer): J1 6*; U1 31(AC1TX/SDA5/SDI4/U2RX/PMA9/CN17/RF4)* 32(AC1RX/SCL5/SDO4/U2TX/PMA8/CN18/RF5)* 33(USBID/RF3)* 34(Vbus)* 35(Vusb)* 36(D-/RG3)* 37(D+/RG2)* 42(RTCC/IC1/INT1/RD8)* 43(SS3/U4RX/U1CTS/SDA1/IC2/INT2/RD9)* 44(SCL1/IC3/PMCS2/PMA15/INT3/RD10)* 45(IC4/PMCS1/PMA14/INT4/RD11)*

### Library data of the parts
C11 C12 = Cap Semi: Capacitor (Semiconductor SIM Model); Value: 20p; Published: 8-Jun-2000; LatestRevisionDate: 29-May-2009; LatestRevisionNote: IPC-7351 Footprint Added.; PackageReference: C1206; Publisher: Altium Limited; PackageDescription: Chip Capacitor
C13 = Cap: Capacitor; Published: 8-Jun-2000; LatestRevisionDate: 17-Jul-2002; LatestRevisionNote: Re-released for DXP Platform.; PackageReference: RAD-0.3; Publisher: Altium Limited; PackageDescription: Radial Cap, Thru-Hole; 2 Leads; 0.3 in Pin Spacing
J1 = Header 6H: Header, 6-Pin, Right Angle; LatestRevisionDate: 17-Jul-2002; LatestRevisionNote: Re-released for DXP Platform.; Publisher: Altium Limited
R3 = Res1: Resistor; Published: 8-Jun-2000; LatestRevisionDate: 17-Jul-2002; LatestRevisionNote: Re-released for DXP Platform.; PackageReference: AXIAL-0.3; Publisher: Altium Limited; PackageDescription: Axial Device, Thru-Hole; 2 Leads; 0.3 in Pin Spacing; Value: 10K
U1 = PIC32 MX575F512H
Y1 = XTAL: Crystal Oscillator; Published: 8-Jun-2000; LatestRevisionDate: 17-Jul-2002; LatestRevisionNote: Re-released for DXP Platform.; PackageReference: R38; Publisher: Altium Limited; PackageDescription: Crystal, Thru-Hole; 2 Leads; Body 3.1 x 8.2 mm (Dia.xH)

## Sheet Display.Schematic.SchDoc
size A
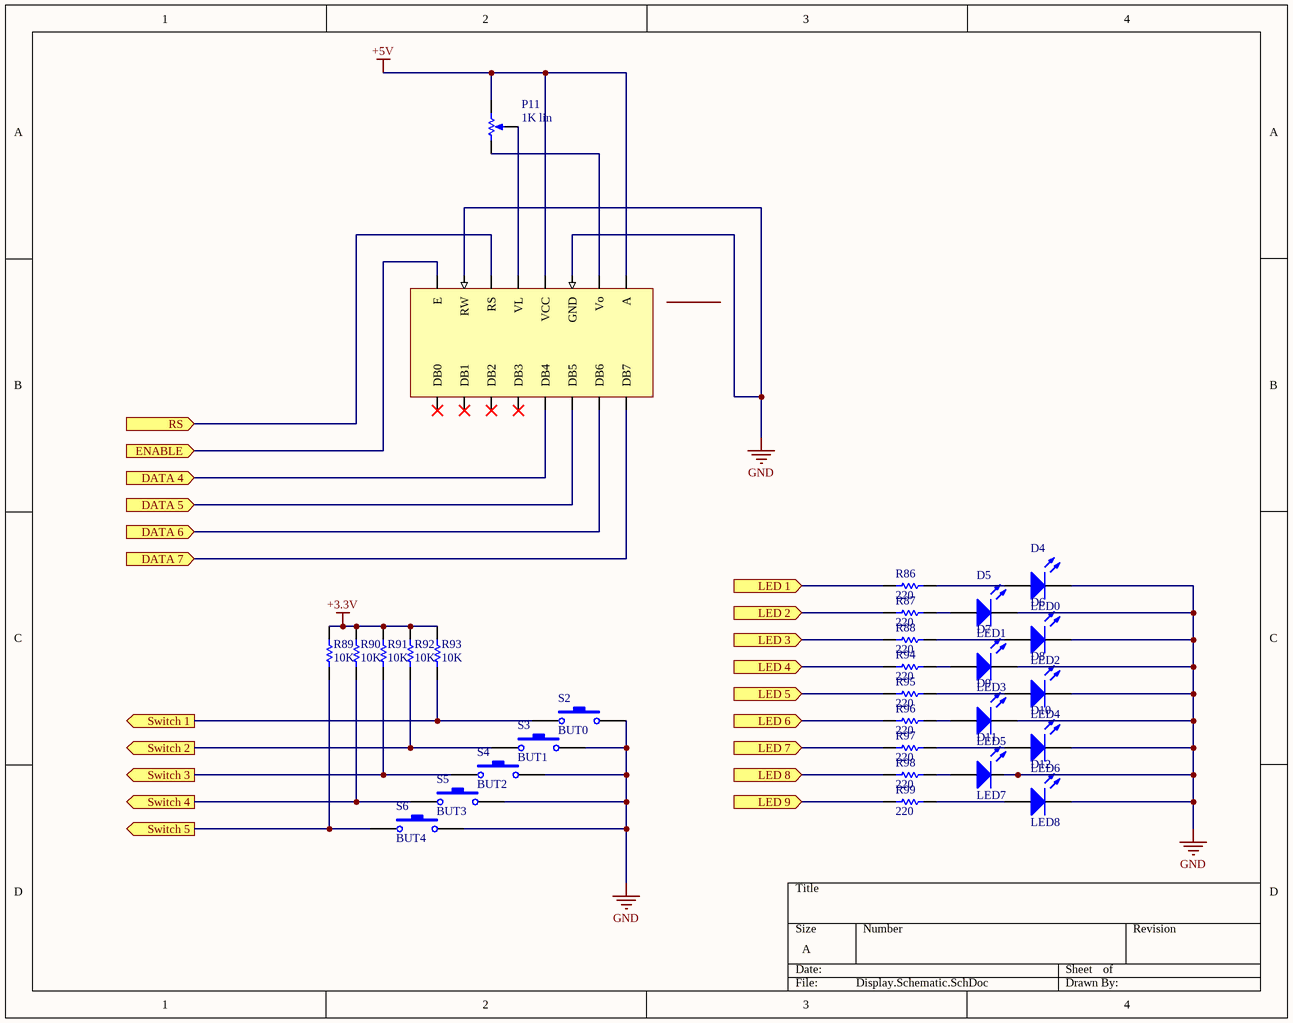
[diagram p7: Display.Schematic.SchDoc]

### Parts
D4  LED0  [LED-0]
D5  LED1  [LED-0]
D6  LED2  [LED-0]
D7  LED3  [LED-0]
D8  LED4  [LED-0]
D9  LED5  [LED-0]
D10  LED6  [LED-0]
D11  LED7  [LED-0]
D12  LED8  [LED-0]
Display  16x2 LCD  [Display]  (value not drawn)
P11  1K lin  [VR5]
R86  220  [CAPC1608N]
R87  220  [CAPC1608N]
R88  220  [CAPC1608N]
R89  10K  [CAPC1608N]
R90  10K  [CAPC1608N]
R91  10K  [CAPC1608N]
R92  10K  [CAPC1608N]
R93  10K  [CAPC1608N]
R94  220  [CAPC1608N]
R95  220  [CAPC1608N]
R96  220  [CAPC1608N]
R97  220  [CAPC1608N]
R98  220  [CAPC1608N]
R99  220  [CAPC1608N]
S2  BUT0  [SPST-2]
S3  BUT1  [SPST-2]
S4  BUT2  [SPST-2]
S5  BUT3  [SPST-2]
S6  BUT4  [SPST-2]

### Ports
DATA 4 (in), DATA 5 (in), DATA 6 (in), DATA 7 (in), ENABLE (in), LED 1 (in), LED 2 (in), LED 3 (in), LED 4 (in), LED 5 (in), LED 6 (in), LED 7 (in), LED 8 (in), LED 9 (in), RS (in), Switch 1 (out), Switch 2 (out), Switch 3 (out), Switch 4 (out), Switch 5 (out)

### Nets
+3.3V: R89.2 R90.2 R91.2 R92.2 R93.2
+5V: Display.2(VCC) Display.16(A) P11.2(BOT)
GND: D4.2(K) D5.2(K) D6.2(K) D7.2(K) D8.2(K) D9.2(K) D10.2(K) D11.2(K) D12.2(K) Display.1(GND) Display.5(RW) S2.2 S3.2 S4.2 S5.2 S6.2
NetD4_1: D4.1(A) R86.2
NetD5_1: D5.1(A) R87.2
NetD6_1: D6.1(A) R88.2
NetD7_1: D7.1(A) R94.2
NetD8_1: D8.1(A) R95.2
NetD9_1: D9.1(A) R96.2
NetD10_1: D10.1(A) R97.2
NetD11_1: D11.1(A) R98.2
NetD12_1: D12.1(A) R99.2
NetDisplay_3: Display.3(VL) P11.3(TAP)
NetDisplay_4: Display.4(RS) ; port RS
NetDisplay_6: Display.6(E) ; port ENABLE
NetDisplay_7: Display.7(DB7) ; port DATA 7
NetDisplay_8: Display.8(DB6) ; port DATA 6
NetDisplay_9: Display.9(DB5) ; port DATA 5
NetDisplay_10: Display.10(DB4) ; port DATA 4
NetDisplay_15: Display.15(Vo) P11.1(TOP)
NetR86_1: R86.1 ; port LED 1
NetR87_1: R87.1 ; port LED 2
NetR88_1: R88.1 ; port LED 3
NetR89_1: R89.1 S6.1 ; port Switch 5
NetR90_1: R90.1 S5.1 ; port Switch 4
NetR91_1: R91.1 S4.1 ; port Switch 3
NetR92_1: R92.1 S3.1 ; port Switch 2
NetR93_1: R93.1 S2.1 ; port Switch 1
NetR94_1: R94.1 ; port LED 4
NetR95_1: R95.1 ; port LED 5
NetR96_1: R96.1 ; port LED 6
NetR97_1: R97.1 ; port LED 7
NetR98_1: R98.1 ; port LED 8
NetR99_1: R99.1 ; port LED 9

Not connected (* = marked no-connect by the designer): Display 11(DB3)* 12(DB2)* 13(DB1)* 14(DB0)*

### Library data of the parts
D4-D12 = LED0: Typical INFRARED GaAs LED; Published: 8-Jun-2000; LatestRevisionDate: 08-Jul-2005; LatestRevisionNote: Mech Layer 1 removed.; PackageReference: LED-0; Publisher: Altium Limited; PackageDescription: LED; 2 Leads
Display = Display
P11 = RPot: Potentiometer; Sim Note: Enter the Resistance value and the set point into parameter fields.; Set Position: 0.5; Value: 10K; Published: 8-Jun-2000; LatestRevisionDate: 17-Jul-2002; LatestRevisionNote: Re-released for DXP Platform.; PackageReference: VR5; Publisher: Altium Limited; PackageDescription: Variable Resistor, Thru-Hole; 3 Leads
R86 R87 R89-R93 = Res1: Resistor; Value: 1K; Published: 8-Jun-2000; LatestRevisionDate: 17-Jul-2002; LatestRevisionNote: Re-released for DXP Platform.; PackageReference: AXIAL-0.3; Publisher: Altium Limited; PackageDescription: Axial Device, Thru-Hole; 2 Leads; 0.3 in Pin Spacing
R88 R94-R99 = Res1: Resistor; Published: 8-Jun-2000; LatestRevisionDate: 17-Jul-2002; LatestRevisionNote: Re-released for DXP Platform.; PackageReference: AXIAL-0.3; Publisher: Altium Limited; PackageDescription: Axial Device, Thru-Hole; 2 Leads; 0.3 in Pin Spacing; Value: 220
S2-S6 = SW-PB: Switch; Published: 24-Mar-1999; LatestRevisionDate: 17-Jul-2002; LatestRevisionNote: Re-released for DXP Platform.; PackageReference: SPST-2; Publisher: Altium Limited; PackageDescription: Switch; 2 Leads

## Sheet Encodeurs.Schematic.SchDoc
size A
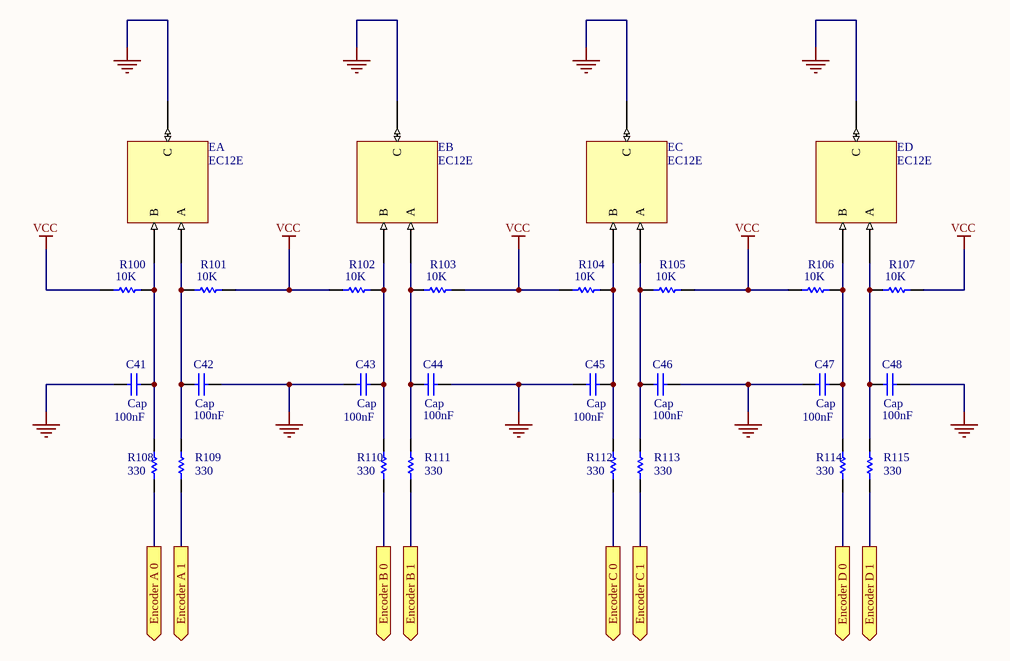
[diagram p8: Encodeurs.Schematic.SchDoc]

### Parts
C41  Cap  value 100nF  [CAPC1608N]
C42  Cap  value 100nF  [CAPC1608N]
C43  Cap  value 100nF  [CAPC1608N]
C44  Cap  value 100nF  [CAPC1608N]
C45  Cap  value 100nF  [CAPC1608N]
C46  Cap  value 100nF  [CAPC1608N]
C47  Cap  value 100nF  [CAPC1608N]
C48  Cap  value 100nF  [CAPC1608N]
EA  EC12E  [EC12E]
EB  EC12E  [EC12E]
EC  EC12E  [EC12E]
ED  EC12E  [EC12E]
R100  10K  [CAPC1608N]
R101  10K  [CAPC1608N]
R102  10K  [CAPC1608N]
R103  10K  [CAPC1608N]
R104  10K  [CAPC1608N]
R105  10K  [CAPC1608N]
R106  10K  [CAPC1608N]
R107  10K  [CAPC1608N]
R108  330  [CAPC1608N]
R109  330  [CAPC1608N]
R110  330  [CAPC1608N]
R111  330  [CAPC1608N]
R112  330  [CAPC1608N]
R113  330  [CAPC1608N]
R114  330  [CAPC1608N]
R115  330  [CAPC1608N]

### Ports
Encoder A 0 (out), Encoder A 1 (out), Encoder B 0 (out), Encoder B 1 (out), Encoder C 0 (out), Encoder C 1 (out), Encoder D 0 (out), Encoder D 1 (out)

### Nets
GND: C41.1 C42.1 C43.1 C44.1 C45.1 C46.1 C47.1 C48.1 EA.GND(C) EB.GND(C) EC.GND(C) ED.GND(C)
VCC: R100.1 R101.2 R102.1 R103.2 R104.1 R105.2 R106.1 R107.2
NetC41_2: C41.2 EA.Pin_B(B) R100.2 R108.2
NetC42_2: C42.2 EA.Pin_A(A) R101.1 R109.2
NetC43_2: C43.2 EB.Pin_B(B) R102.2 R110.2
NetC44_2: C44.2 EB.Pin_A(A) R103.1 R111.2
NetC45_2: C45.2 EC.Pin_B(B) R104.2 R112.2
NetC46_2: C46.2 EC.Pin_A(A) R105.1 R113.2
NetC47_2: C47.2 ED.Pin_B(B) R106.2 R114.2
NetC48_2: C48.2 ED.Pin_A(A) R107.1 R115.2
NetR108_1: R108.1 ; port Encoder A 0
NetR109_1: R109.1 ; port Encoder A 1
NetR110_1: R110.1 ; port Encoder B 0
NetR111_1: R111.1 ; port Encoder B 1
NetR112_1: R112.1 ; port Encoder C 0
NetR113_1: R113.1 ; port Encoder C 1
NetR114_1: R114.1 ; port Encoder D 0
NetR115_1: R115.1 ; port Encoder D 1

### Library data of the parts
C41-C48 = Cap: Capacitor; Published: 8-Jun-2000; LatestRevisionDate: 17-Jul-2002; LatestRevisionNote: Re-released for DXP Platform.; PackageReference: RAD-0.3; Publisher: Altium Limited; PackageDescription: Radial Cap, Thru-Hole; 2 Leads; 0.3 in Pin Spacing
R100-R107 = Res1: Resistor; Published: 8-Jun-2000; LatestRevisionDate: 17-Jul-2002; LatestRevisionNote: Re-released for DXP Platform.; PackageReference: AXIAL-0.3; Publisher: Altium Limited; PackageDescription: Axial Device, Thru-Hole; 2 Leads; 0.3 in Pin Spacing; Value: 10K
R108-R115 = Res1: Resistor; Value: 330R; Published: 8-Jun-2000; LatestRevisionDate: 17-Jul-2002; LatestRevisionNote: Re-released for DXP Platform.; PackageReference: AXIAL-0.3; Publisher: Altium Limited; PackageDescription: Axial Device, Thru-Hole; 2 Leads; 0.3 in Pin Spacing

## Sheet PSU.Schematic.SchDoc
size A
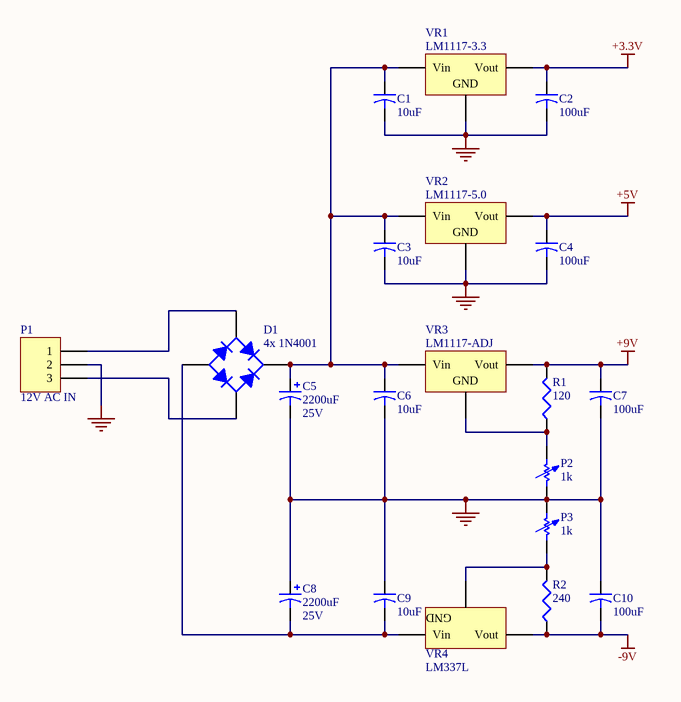
[diagram p9: PSU.Schematic.SchDoc]

### Parts
C1  10uF  [CAPC1608N]
C2  100uF  [CAPC1608N]
C3  10uF  [CAPC1608N]
C4  100uF  [CAPC1608N]
C5  2200uF  value 25V  [CAPC1608N]
C6  10uF  [CAPC1608N]
C7  100uF  [CAPC1608N]
C8  2200uF  value 25V  [CAPC1608N]
C9  10uF  [CAPC1608N]
C10  100uF  [CAPC1608N]
D1  4x 1N4001  [1N4001]
P1  12V AC IN  [HDR1X3]
P2  1k  [CAPC1608N]
P3  1k  [CAPC1608N]
R1  120  [CAPC1608N]
R2  240  [CAPC1608N]
VR1  LM1117-3.3  [LM1117]
VR2  LM1117-5.0  [LM1117]
VR3  LM1117-ADJ  [LM1117]
VR4  LM337L  [LM337L]

### Nets
+3.3V: C2.1 VR1.3(Vout)
+5V: C4.1 VR2.3(Vout)
+9V: C7.1 R1.2 VR3.3(Vout)
-9V: C10.2 R2.1 VR4.3(Vout)
GND: C1.2 C2.2 C3.2 C4.2 C5.2 C6.2 C7.2 C8.1 C9.1 C10.1 P1.2 P2.1 P3.2 VR1.2(GND) VR2.2(GND)
NetC1_1: C1.1 C3.1 C5.1 C6.1 D1.1(K) VR1.1(Vin) VR2.1(Vin) VR3.1(Vin)
NetC8_2: C8.2 C9.2 D1.3(A) VR4.1(Vin)
NetD1_2: D1.2(C) P1.3
NetD1_4: D1.4(C) P1.1
NetP2_2: P2.2 R1.1 VR3.2(ADJ)
NetP3_1: P3.1 R2.2 VR4.2(ADJ)

### Notes on the sheet
- (in symbol Volt Reg) GND

### Library data of the parts
C1 C3 C6 C9 = Cap2: Capacitor; Value: 10u; Published: 23-Sep-2002; PackageReference: CAPR5-4X5; Publisher: Altium Limited; PackageDescription: Capacitor; 2 Leads
C2 C4 C7 C10 = Cap2: Capacitor; Value: 100u; Published: 23-Sep-2002; PackageReference: CAPR5-4X5; Publisher: Altium Limited; PackageDescription: Capacitor; 2 Leads
C5 C8 = Cap Pol1: Polarized Capacitor (Radial); Published: 8-Jun-2000; LatestRevisionDate: 17-Jul-2002; LatestRevisionNote: Re-released for DXP Platform.; PackageReference: RB7.6-15; Publisher: Altium Limited; PackageDescription: Polarized Capacitor (Radial); 2 Leads
D1 = Bridge1: Full Wave Diode Bridge; Published: 8-Jun-2000; LatestRevisionDate: 29-May-2009; LatestRevisionNote: Sch pins A & K swapped.; DatasheetVersion: E2732B; PackageReference: D-38; Publisher: Altium Limited; PackageDescription: Bridge Rectifier; 4 Terminals; Body 9.4 x 9.4 mm (typ); Pitch 5.08 mm
P1 = Header 3: Header, 3-Pin; LatestRevisionDate: 17-Jul-2002; LatestRevisionNote: Re-released for DXP Platform.; Publisher: Altium Limited
P2 P3 = Res Adj1: Variable Resistor; Set Position: 0.5; Published: 8-Jun-2000; LatestRevisionDate: 17-Jul-2002; LatestRevisionNote: Re-released for DXP Platform.; PackageReference: AXIAL-0.7; Publisher: Altium Limited; PackageDescription: Axial Device, Thru-Hole; 2 Leads; 0.7 in Pin Spacing; Value: 1K
R1 R2 = Res3: Resistor; Published: 8-Jun-2000; LatestRevisionDate: 29-May-2009; LatestRevisionNote: IPC-7351 Footprint Added.; PackageReference: J1-0603; Publisher: Altium Limited; PackageDescription: Chip Resistor
  R1: Value: 120
  R2: Value: 240
VR1-VR4 = Volt Reg: Voltage Regulator; Published: 24-Mar-1999; LatestRevisionDate: 29-May-2009; LatestRevisionNote: IPC-7351 Footprint Added.; PackageReference: D2PAK; Publisher: Altium Limited; PackageDescription: 3-Pin Transistor Outline Package 2.54 mm Pitch, 15.1 mm Lead Span

## Nets that join several sheets
+3.3V: Display.Schematic (5 pins), PSU.Schematic (C2.1 VR1.3)
+5V: Output.Schematic (U22.5 U22.6), DAC.Schematic (C16.1 C17.2 U2.11), MIDI.Schematic (R4.2 R6.2 U26.?3), Display.Schematic (Display.2 Display.16 P11.2), PSU.Schematic (C4.1 VR2.3)
+9V: FilterBoard.Schematic (14 pins), Output.Schematic (U23.8 U24.8 U25.4), FilterControl.Schematic (U19.4 U20.4 U21.4), PSU.Schematic (C7.1 R1.2 VR3.3)
-9V: FilterBoard.Schematic (16 pins), Output.Schematic (U23.4 U24.4 U25.11), FilterControl.Schematic (5 pins), PSU.Schematic (C10.2 R2.1 VR4.3)
GND: FilterBoard.Schematic (32 pins), Output.Schematic (8 pins), FilterControl.Schematic (9 pins), MIDI.Schematic (J3.2 R8.1 U26.?4), PIC.Schematic (8 pins), Display.Schematic (16 pins), Encodeurs.Schematic (12 pins), PSU.Schematic (15 pins)
NetC14_2: FilterBoard.Schematic (R16.1), Output.Schematic (U22.2), DAC.Schematic (C14.2)
NetDisplay_4: PIC.Schematic (U1.29), Display.Schematic (Display.4)
NetDisplay_6: PIC.Schematic (U1.30), Display.Schematic (Display.6)
NetDisplay_7: PIC.Schematic (U1.23), Display.Schematic (Display.7)
NetDisplay_8: PIC.Schematic (U1.24), Display.Schematic (Display.8)
NetDisplay_9: PIC.Schematic (U1.27), Display.Schematic (Display.9)
NetDisplay_10: PIC.Schematic (U1.28), Display.Schematic (Display.10)
NetR6_1: MIDI.Schematic (R6.1 R7.2 U26.?6), PIC.Schematic (U1.21)
NetR9_1: DAC.Schematic (R9.1), PIC.Schematic (U1.51)
NetR10_1: DAC.Schematic (R10.1), PIC.Schematic (U1.6)
NetR11_1: DAC.Schematic (R11.1), PIC.Schematic (U1.4)
NetR12_1: DAC.Schematic (R12.1), PIC.Schematic (U1.52)
NetR14_2: FilterBoard.Schematic (R14.2), Output.Schematic (U22.9)
NetR15_2: FilterBoard.Schematic (R15.2), Output.Schematic (U22.7)
NetR22_2: FilterBoard.Schematic (R22.2), Output.Schematic (U22.4)
NetR48_1: FilterBoard.Schematic (R48.1), FilterControl.Schematic (R75.1 U20.1)
NetR53_1: FilterBoard.Schematic (R53.1), FilterControl.Schematic (R78.1 U21.1)
NetR57_1: FilterBoard.Schematic (R57.1), FilterControl.Schematic (R69.1 U19.1)
NetR65_1: FilterControl.Schematic (R65.1), PIC.Schematic (U1.46)
NetR71_1: FilterControl.Schematic (R71.1), PIC.Schematic (U1.49)
NetR76_1: FilterControl.Schematic (R76.1), PIC.Schematic (U1.50)
NetR86_1: PIC.Schematic (U1.53), Display.Schematic (R86.1)
NetR87_1: PIC.Schematic (U1.54), Display.Schematic (R87.1)
NetR88_1: PIC.Schematic (U1.55), Display.Schematic (R88.1)
NetR89_1: PIC.Schematic (U1.18), Display.Schematic (R89.1 S6.1)
NetR90_1: PIC.Schematic (U1.11), Display.Schematic (R90.1 S5.1)
NetR91_1: PIC.Schematic (U1.1), Display.Schematic (R91.1 S4.1)
NetR92_1: PIC.Schematic (U1.60), Display.Schematic (R92.1 S3.1)
NetR93_1: PIC.Schematic (U1.59), Display.Schematic (R93.1 S2.1)
NetR94_1: PIC.Schematic (U1.58), Display.Schematic (R94.1)
NetR95_1: PIC.Schematic (U1.2), Display.Schematic (R95.1)
NetR96_1: PIC.Schematic (U1.3), Display.Schematic (R96.1)
NetR97_1: PIC.Schematic (U1.5), Display.Schematic (R97.1)
NetR98_1: PIC.Schematic (U1.8), Display.Schematic (R98.1)
NetR99_1: PIC.Schematic (U1.22), Display.Schematic (R99.1)
NetR108_1: PIC.Schematic (U1.61), Encodeurs.Schematic (R108.1)
NetR109_1: PIC.Schematic (U1.62), Encodeurs.Schematic (R109.1)
NetR110_1: PIC.Schematic (U1.63), Encodeurs.Schematic (R110.1)
NetR111_1: PIC.Schematic (U1.64), Encodeurs.Schematic (R111.1)
NetR112_1: PIC.Schematic (U1.12), Encodeurs.Schematic (R112.1)
NetR113_1: PIC.Schematic (U1.13), Encodeurs.Schematic (R113.1)
NetR114_1: PIC.Schematic (U1.14), Encodeurs.Schematic (R114.1)
NetR115_1: PIC.Schematic (U1.17), Encodeurs.Schematic (R115.1)
NetU1_47: Output.Schematic (U22.10), PIC.Schematic (U1.47)
NetU1_48: Output.Schematic (U22.1), PIC.Schematic (U1.48)